# Altium schematic sheet matrix_sh.SchDoc
size A2 portrait
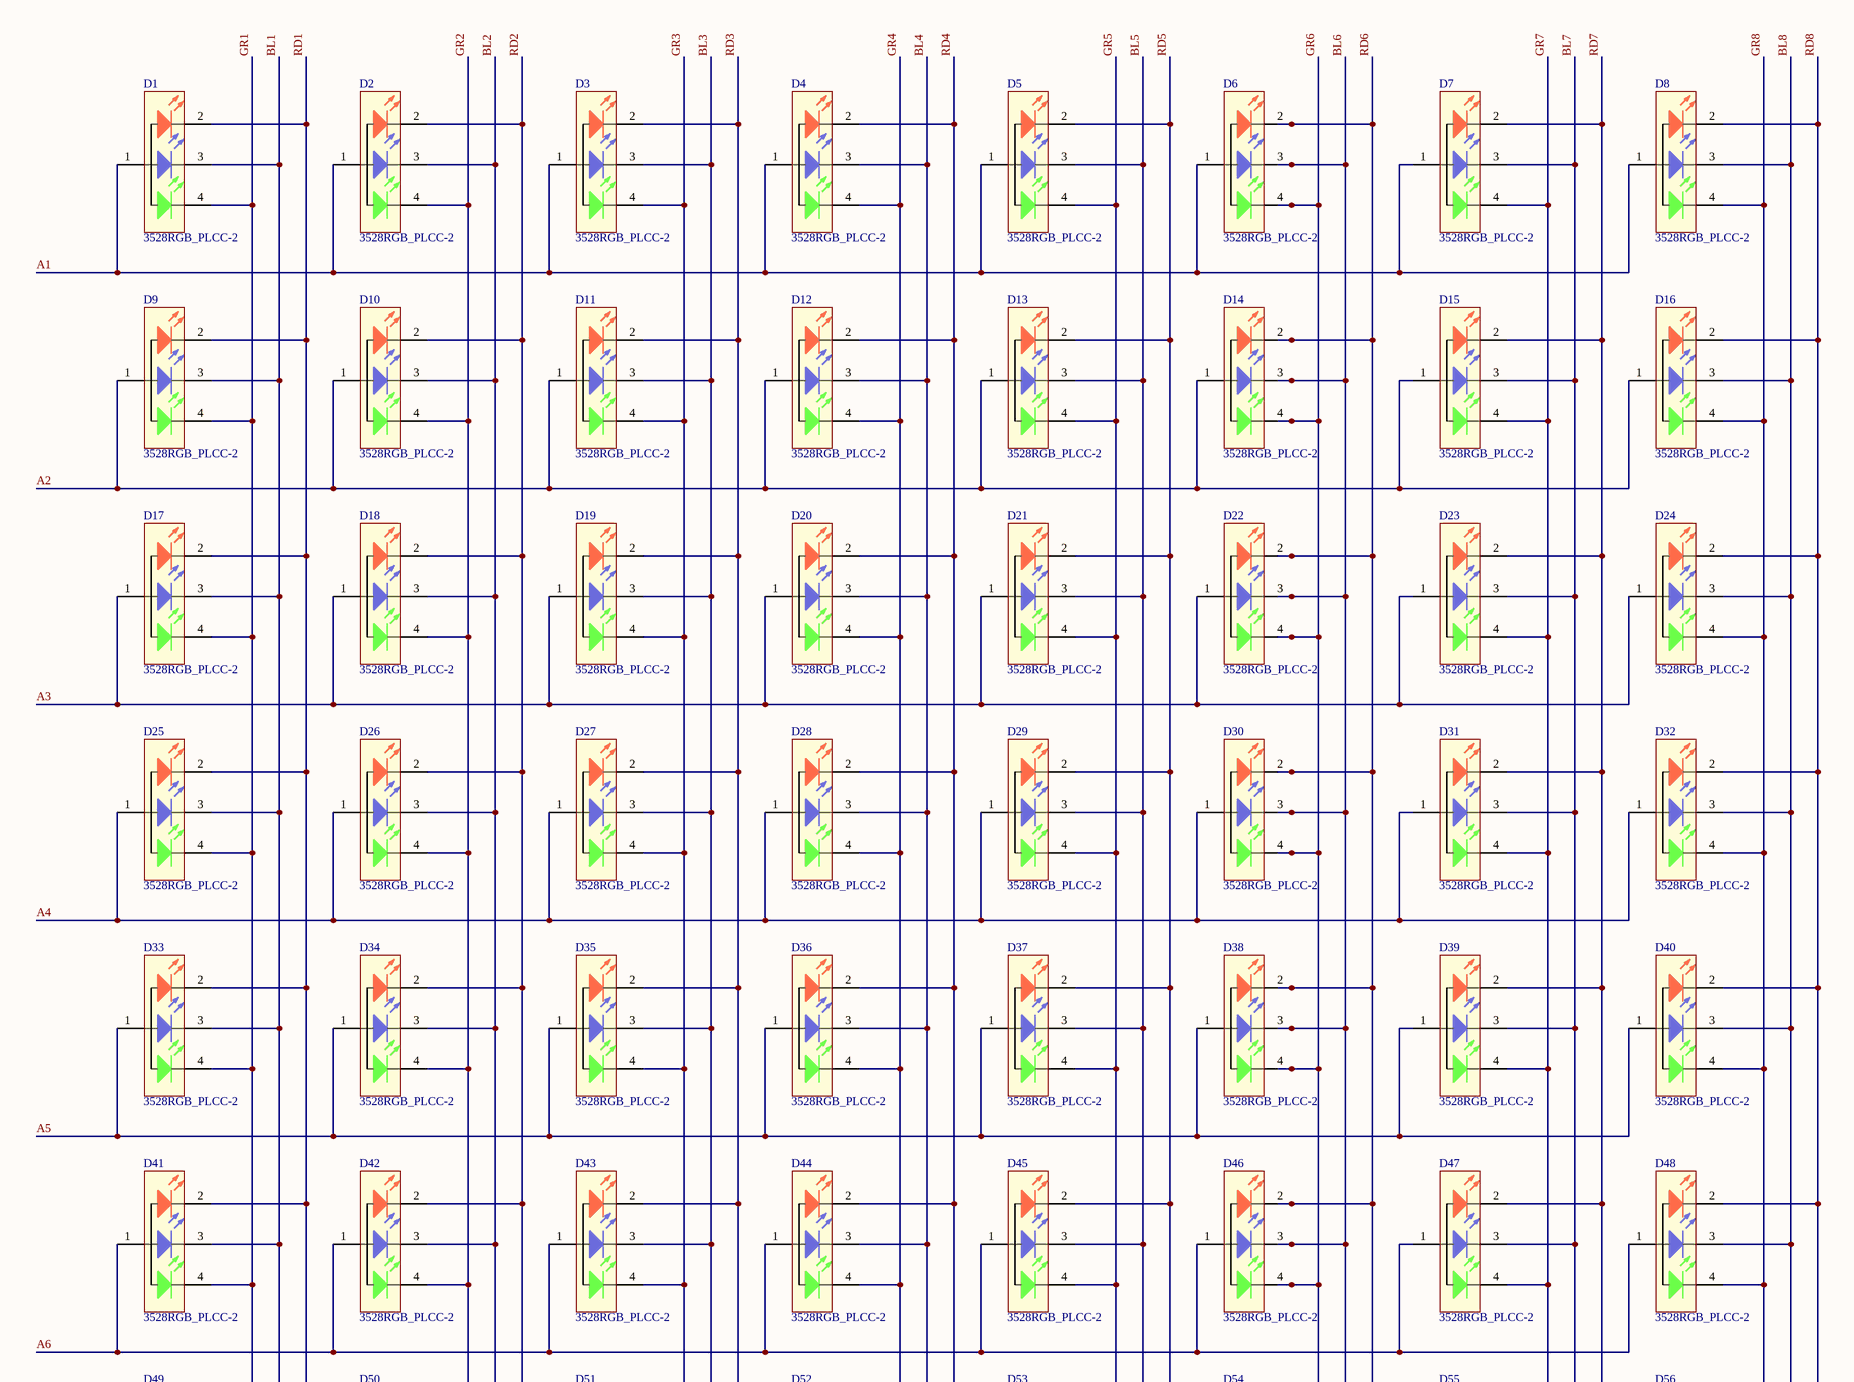
[diagram p0: matrix_sh.SchDoc, top]
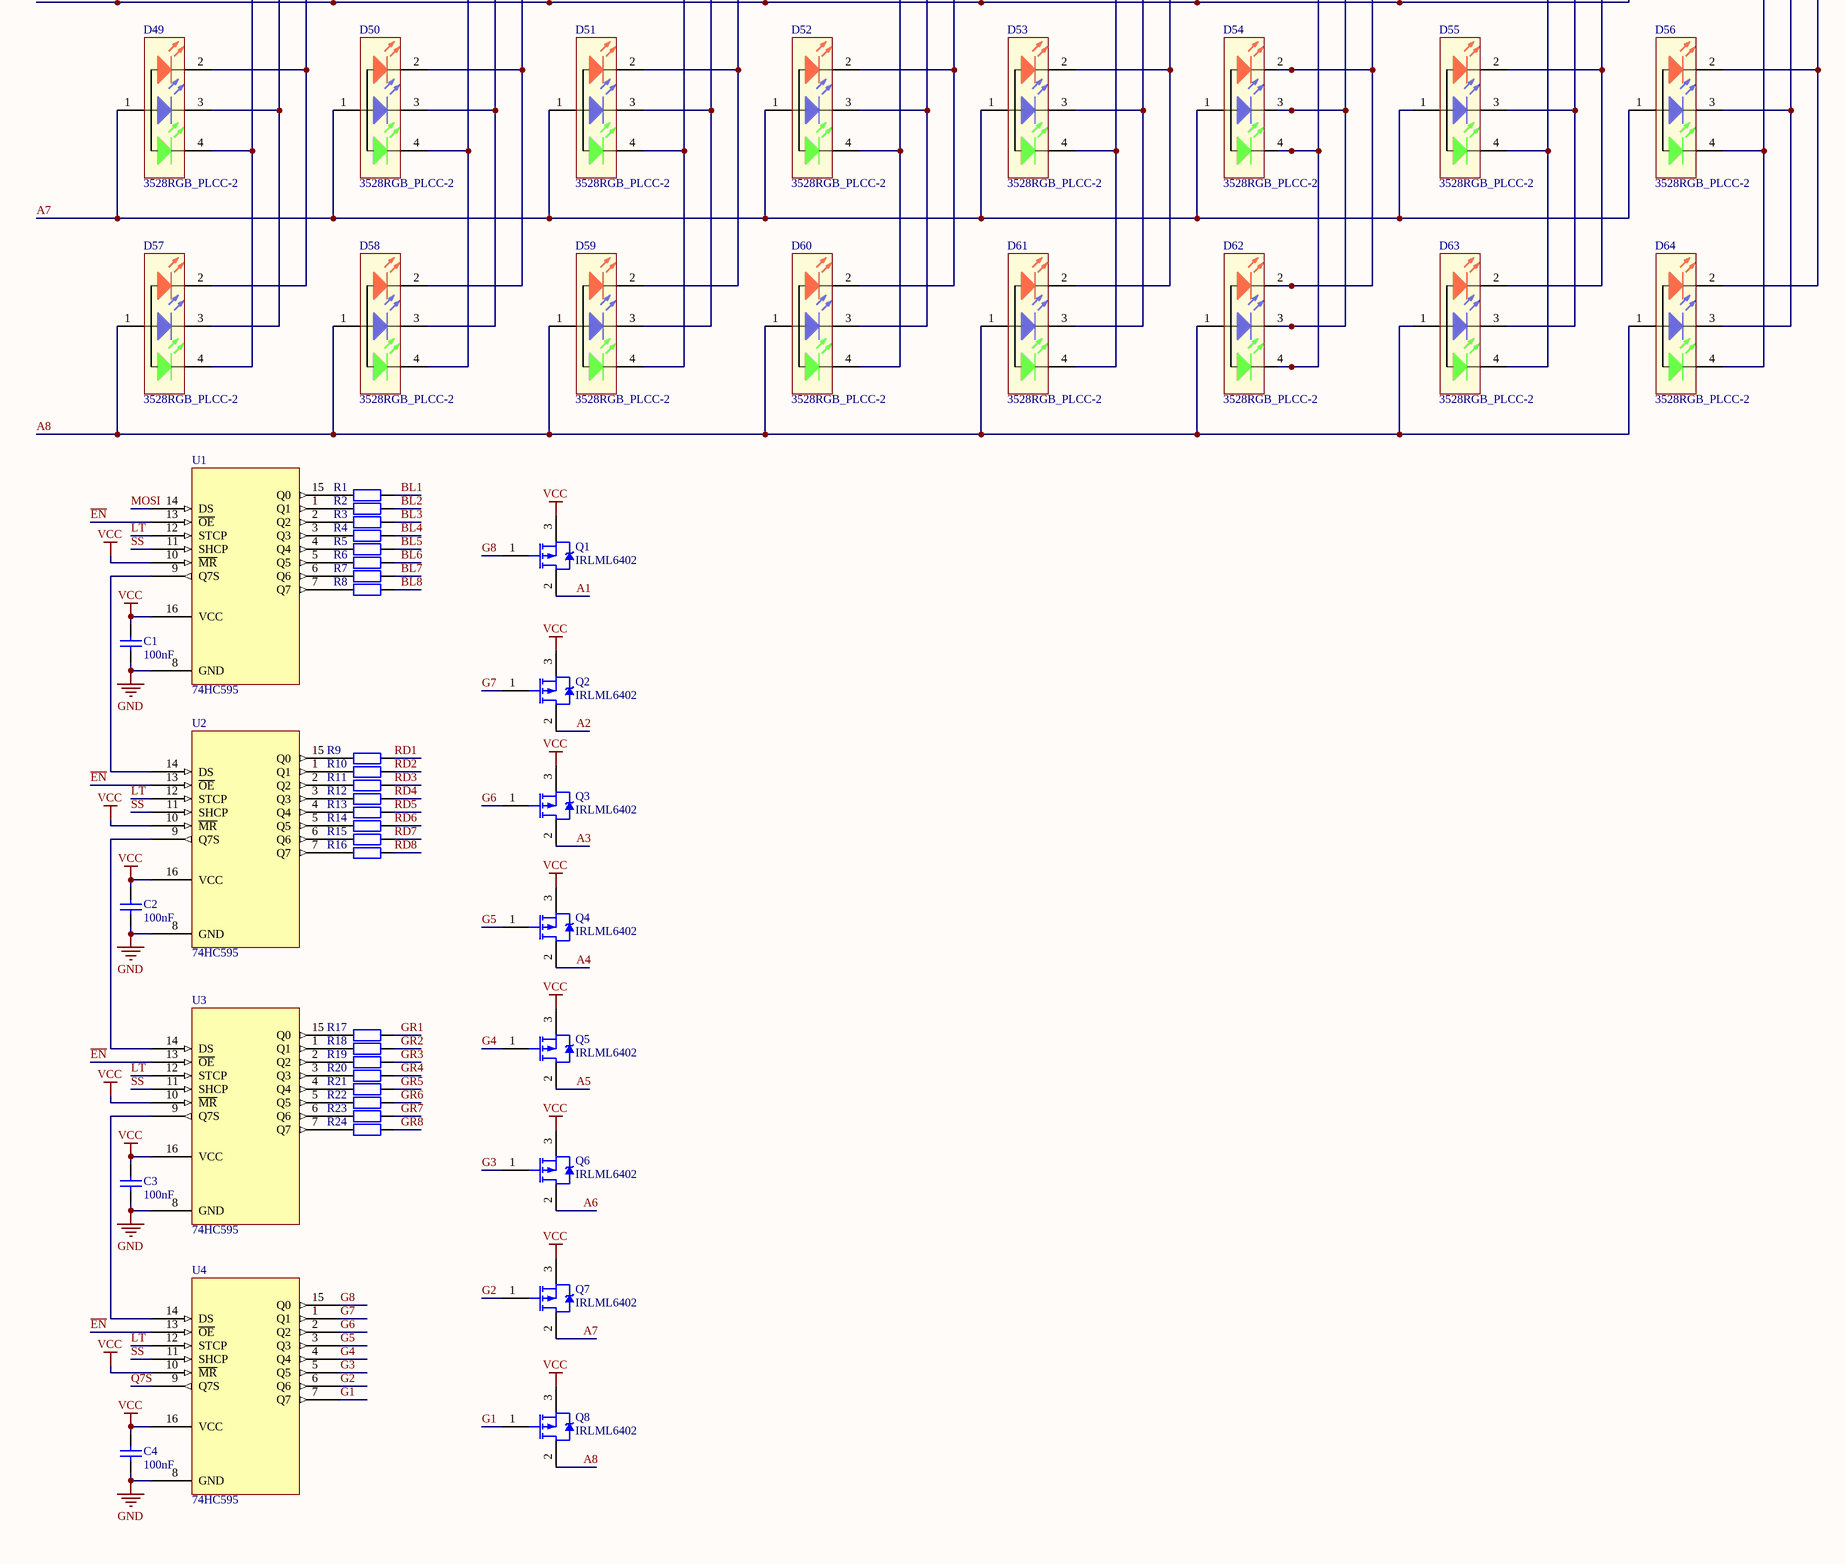
[diagram p1: matrix_sh.SchDoc, bottom]

## Parts
C1  value 100nF  [6-0805_M]  (hidden comment: Cap)
C2  value 100nF  [6-0805_M]  (hidden comment: Cap)
C3  value 100nF  [6-0805_M]  (hidden comment: Cap)
C4  value 100nF  [6-0805_M]  (hidden comment: Cap)
D1  3528RGB_PLCC-2  [PLCC-4 3528]
D2  3528RGB_PLCC-2  [PLCC-4 3528]
D3  3528RGB_PLCC-2  [PLCC-4 3528]
D4  3528RGB_PLCC-2  [PLCC-4 3528]
D5  3528RGB_PLCC-2  [PLCC-4 3528]
D6  3528RGB_PLCC-2  [PLCC-4 3528]
D7  3528RGB_PLCC-2  [PLCC-4 3528]
D8  3528RGB_PLCC-2  [PLCC-4 3528]
D9  3528RGB_PLCC-2  [PLCC-4 3528]
D10  3528RGB_PLCC-2  [PLCC-4 3528]
D11  3528RGB_PLCC-2  [PLCC-4 3528]
D12  3528RGB_PLCC-2  [PLCC-4 3528]
D13  3528RGB_PLCC-2  [PLCC-4 3528]
D14  3528RGB_PLCC-2  [PLCC-4 3528]
D15  3528RGB_PLCC-2  [PLCC-4 3528]
D16  3528RGB_PLCC-2  [PLCC-4 3528]
D17  3528RGB_PLCC-2  [PLCC-4 3528]
D18  3528RGB_PLCC-2  [PLCC-4 3528]
D19  3528RGB_PLCC-2  [PLCC-4 3528]
D20  3528RGB_PLCC-2  [PLCC-4 3528]
D21  3528RGB_PLCC-2  [PLCC-4 3528]
D22  3528RGB_PLCC-2  [PLCC-4 3528]
D23  3528RGB_PLCC-2  [PLCC-4 3528]
D24  3528RGB_PLCC-2  [PLCC-4 3528]
D25  3528RGB_PLCC-2  [PLCC-4 3528]
D26  3528RGB_PLCC-2  [PLCC-4 3528]
D27  3528RGB_PLCC-2  [PLCC-4 3528]
D28  3528RGB_PLCC-2  [PLCC-4 3528]
D29  3528RGB_PLCC-2  [PLCC-4 3528]
D30  3528RGB_PLCC-2  [PLCC-4 3528]
D31  3528RGB_PLCC-2  [PLCC-4 3528]
D32  3528RGB_PLCC-2  [PLCC-4 3528]
D33  3528RGB_PLCC-2  [PLCC-4 3528]
D34  3528RGB_PLCC-2  [PLCC-4 3528]
D35  3528RGB_PLCC-2  [PLCC-4 3528]
D36  3528RGB_PLCC-2  [PLCC-4 3528]
D37  3528RGB_PLCC-2  [PLCC-4 3528]
D38  3528RGB_PLCC-2  [PLCC-4 3528]
D39  3528RGB_PLCC-2  [PLCC-4 3528]
D40  3528RGB_PLCC-2  [PLCC-4 3528]
D41  3528RGB_PLCC-2  [PLCC-4 3528]
D42  3528RGB_PLCC-2  [PLCC-4 3528]
D43  3528RGB_PLCC-2  [PLCC-4 3528]
D44  3528RGB_PLCC-2  [PLCC-4 3528]
D45  3528RGB_PLCC-2  [PLCC-4 3528]
D46  3528RGB_PLCC-2  [PLCC-4 3528]
D47  3528RGB_PLCC-2  [PLCC-4 3528]
D48  3528RGB_PLCC-2  [PLCC-4 3528]
D49  3528RGB_PLCC-2  [PLCC-4 3528]
D50  3528RGB_PLCC-2  [PLCC-4 3528]
D51  3528RGB_PLCC-2  [PLCC-4 3528]
D52  3528RGB_PLCC-2  [PLCC-4 3528]
D53  3528RGB_PLCC-2  [PLCC-4 3528]
D54  3528RGB_PLCC-2  [PLCC-4 3528]
D55  3528RGB_PLCC-2  [PLCC-4 3528]
D56  3528RGB_PLCC-2  [PLCC-4 3528]
D57  3528RGB_PLCC-2  [PLCC-4 3528]
D58  3528RGB_PLCC-2  [PLCC-4 3528]
D59  3528RGB_PLCC-2  [PLCC-4 3528]
D60  3528RGB_PLCC-2  [PLCC-4 3528]
D61  3528RGB_PLCC-2  [PLCC-4 3528]
D62  3528RGB_PLCC-2  [PLCC-4 3528]
D63  3528RGB_PLCC-2  [PLCC-4 3528]
D64  3528RGB_PLCC-2  [PLCC-4 3528]
Q1  IRLML6402  [SOT95P237X112-3N]
Q2  IRLML6402  [SOT95P237X112-3N]
Q3  IRLML6402  [SOT95P237X112-3N]
Q4  IRLML6402  [SOT95P237X112-3N]
Q5  IRLML6402  [SOT95P237X112-3N]
Q6  IRLML6402  [SOT95P237X112-3N]
Q7  IRLML6402  [SOT95P237X112-3N]
Q8  IRLML6402  [SOT95P237X112-3N]
R1  Res2  [6-0805_M]  (value not drawn)
R2  Res2  [6-0805_M]  (value not drawn)
R3  Res2  [6-0805_M]  (value not drawn)
R4  Res2  [6-0805_M]  (value not drawn)
R5  Res2  [6-0805_M]  (value not drawn)
R6  Res2  [6-0805_M]  (value not drawn)
R7  Res2  [6-0805_M]  (value not drawn)
R8  Res2  [6-0805_M]  (value not drawn)
R9  Res2  [6-0805_M]  (value not drawn)
R10  Res2  [6-0805_M]  (value not drawn)
R11  Res2  [6-0805_M]  (value not drawn)
R12  Res2  [6-0805_M]  (value not drawn)
R13  Res2  [6-0805_M]  (value not drawn)
R14  Res2  [6-0805_M]  (value not drawn)
R15  Res2  [6-0805_M]  (value not drawn)
R16  Res2  [6-0805_M]  (value not drawn)
R17  Res2  [6-0805_M]  (value not drawn)
R18  Res2  [6-0805_M]  (value not drawn)
R19  Res2  [6-0805_M]  (value not drawn)
R20  Res2  [6-0805_M]  (value not drawn)
R21  Res2  [6-0805_M]  (value not drawn)
R22  Res2  [6-0805_M]  (value not drawn)
R23  Res2  [6-0805_M]  (value not drawn)
R24  Res2  [6-0805_M]  (value not drawn)
U1  74HC595  [TSOP65P640X110-16M]
U2  74HC595  [TSOP65P640X110-16M]
U3  74HC595  [TSOP65P640X110-16M]
U4  74HC595  [TSOP65P640X110-16M]

## Nets
GND: C1.1 C2.1 C3.1 C4.1 U1.8(GND) U2.8(GND) U3.8(GND) U4.8(GND)
VCC: C1.2 C2.2 C3.2 C4.2 Q1.3(S) Q2.3(S) Q3.3(S) Q4.3(S) Q5.3(S) Q6.3(S) Q7.3(S) Q8.3(S) U1.10(~{MR}) U1.16(VCC) U2.10(~{MR}) U2.16(VCC) U3.10(~{MR}) U3.16(VCC) U4.10(~{MR}) U4.16(VCC)
A1: D1.1(A) D2.1(A) D3.1(A) D4.1(A) D5.1(A) D6.1(A) D7.1(A) D8.1(A) Q1.2(D)
A2: D9.1(A) D10.1(A) D11.1(A) D12.1(A) D13.1(A) D14.1(A) D15.1(A) D16.1(A) Q2.2(D)
A3: D17.1(A) D18.1(A) D19.1(A) D20.1(A) D21.1(A) D22.1(A) D23.1(A) D24.1(A) Q3.2(D)
A4: D25.1(A) D26.1(A) D27.1(A) D28.1(A) D29.1(A) D30.1(A) D31.1(A) D32.1(A) Q4.2(D)
A5: D33.1(A) D34.1(A) D35.1(A) D36.1(A) D37.1(A) D38.1(A) D39.1(A) D40.1(A) Q5.2(D)
A6: D41.1(A) D42.1(A) D43.1(A) D44.1(A) D45.1(A) D46.1(A) D47.1(A) D48.1(A) Q6.2(D)
A7: D49.1(A) D50.1(A) D51.1(A) D52.1(A) D53.1(A) D54.1(A) D55.1(A) D56.1(A) Q7.2(D)
A8: D57.1(A) D58.1(A) D59.1(A) D60.1(A) D61.1(A) D62.1(A) D63.1(A) D64.1(A) Q8.2(D)
BL1: D1.3(K) D9.3(K) D17.3(K) D25.3(K) D33.3(K) D41.3(K) D49.3(K) D57.3(K) R1.2
BL2: D2.3(K) D10.3(K) D18.3(K) D26.3(K) D34.3(K) D42.3(K) D50.3(K) D58.3(K) R2.2
BL3: D3.3(K) D11.3(K) D19.3(K) D27.3(K) D35.3(K) D43.3(K) D51.3(K) D59.3(K) R3.2
BL4: D4.3(K) D12.3(K) D20.3(K) D28.3(K) D36.3(K) D44.3(K) D52.3(K) D60.3(K) R4.2
BL5: D5.3(K) D13.3(K) D21.3(K) D29.3(K) D37.3(K) D45.3(K) D53.3(K) D61.3(K) R5.2
BL6: D6.3(K) D14.3(K) D22.3(K) D30.3(K) D38.3(K) D46.3(K) D54.3(K) D62.3(K) R6.2
BL7: D7.3(K) D15.3(K) D23.3(K) D31.3(K) D39.3(K) D47.3(K) D55.3(K) D63.3(K) R7.2
BL8: D8.3(K) D16.3(K) D24.3(K) D32.3(K) D40.3(K) D48.3(K) D56.3(K) D64.3(K) R8.2
~{EN}: U1.13(~{OE}) U2.13(~{OE}) U3.13(~{OE}) U4.13(~{OE})
G1: Q8.1(G) U4.7(Q7)
G2: Q7.1(G) U4.6(Q6)
G3: Q6.1(G) U4.5(Q5)
G4: Q5.1(G) U4.4(Q4)
G5: Q4.1(G) U4.3(Q3)
G6: Q3.1(G) U4.2(Q2)
G7: Q2.1(G) U4.1(Q1)
G8: Q1.1(G) U4.15(Q0)
GR1: D1.4(K) D9.4(K) D17.4(K) D25.4(K) D33.4(K) D41.4(K) D49.4(K) D57.4(K) R17.2
GR2: D2.4(K) D10.4(K) D18.4(K) D26.4(K) D34.4(K) D42.4(K) D50.4(K) D58.4(K) R18.2
GR3: D3.4(K) D11.4(K) D19.4(K) D27.4(K) D35.4(K) D43.4(K) D51.4(K) D59.4(K) R19.2
GR4: D4.4(K) D12.4(K) D20.4(K) D28.4(K) D36.4(K) D44.4(K) D52.4(K) D60.4(K) R20.2
GR5: D5.4(K) D13.4(K) D21.4(K) D29.4(K) D37.4(K) D45.4(K) D53.4(K) D61.4(K) R21.2
GR6: D6.4(K) D14.4(K) D22.4(K) D30.4(K) D38.4(K) D46.4(K) D54.4(K) D62.4(K) R22.2
GR7: D7.4(K) D15.4(K) D23.4(K) D31.4(K) D39.4(K) D47.4(K) D55.4(K) D63.4(K) R23.2
GR8: D8.4(K) D16.4(K) D24.4(K) D32.4(K) D40.4(K) D48.4(K) D56.4(K) D64.4(K) R24.2
LT: U1.12(STCP) U2.12(STCP) U3.12(STCP) U4.12(STCP)
MOSI: U1.14(DS)
Q7S: U4.9(Q7S)
RD1: D1.2(K) D9.2(K) D17.2(K) D25.2(K) D33.2(K) D41.2(K) D49.2(K) D57.2(K) R9.2
RD2: D2.2(K) D10.2(K) D18.2(K) D26.2(K) D34.2(K) D42.2(K) D50.2(K) D58.2(K) R10.2
RD3: D3.2(K) D11.2(K) D19.2(K) D27.2(K) D35.2(K) D43.2(K) D51.2(K) D59.2(K) R11.2
RD4: D4.2(K) D12.2(K) D20.2(K) D28.2(K) D36.2(K) D44.2(K) D52.2(K) D60.2(K) R12.2
RD5: D5.2(K) D13.2(K) D21.2(K) D29.2(K) D37.2(K) D45.2(K) D53.2(K) D61.2(K) R13.2
RD6: D6.2(K) D14.2(K) D22.2(K) D30.2(K) D38.2(K) D46.2(K) D54.2(K) D62.2(K) R14.2
RD7: D7.2(K) D15.2(K) D23.2(K) D31.2(K) D39.2(K) D47.2(K) D55.2(K) D63.2(K) R15.2
RD8: D8.2(K) D16.2(K) D24.2(K) D32.2(K) D40.2(K) D48.2(K) D56.2(K) D64.2(K) R16.2
SS: U1.11(SHCP) U2.11(SHCP) U3.11(SHCP) U4.11(SHCP)
NetR1_1: R1.1 U1.15(Q0)
NetR2_1: R2.1 U1.1(Q1)
NetR3_1: R3.1 U1.2(Q2)
NetR4_1: R4.1 U1.3(Q3)
NetR5_1: R5.1 U1.4(Q4)
NetR6_1: R6.1 U1.5(Q5)
NetR7_1: R7.1 U1.6(Q6)
NetR8_1: R8.1 U1.7(Q7)
NetR9_1: R9.1 U2.15(Q0)
NetR10_1: R10.1 U2.1(Q1)
NetR11_1: R11.1 U2.2(Q2)
NetR12_1: R12.1 U2.3(Q3)
NetR13_1: R13.1 U2.4(Q4)
NetR14_1: R14.1 U2.5(Q5)
NetR15_1: R15.1 U2.6(Q6)
NetR16_1: R16.1 U2.7(Q7)
NetR17_1: R17.1 U3.15(Q0)
NetR18_1: R18.1 U3.1(Q1)
NetR19_1: R19.1 U3.2(Q2)
NetR20_1: R20.1 U3.3(Q3)
NetR21_1: R21.1 U3.4(Q4)
NetR22_1: R22.1 U3.5(Q5)
NetR23_1: R23.1 U3.6(Q6)
NetR24_1: R24.1 U3.7(Q7)
NetU1_9: U1.9(Q7S) U2.14(DS)
NetU2_9: U2.9(Q7S) U3.14(DS)
NetU3_9: U3.9(Q7S) U4.14(DS)

## Library data of the parts
C1-C4 = Cap: Capacitor; Published: 8-Jun-2000; LatestRevisionDate: 17-Jul-2002; LatestRevisionNote: Re-released for DXP Platform.; PackageReference: RAD-0.3; Publisher: Altium Limited; PackageDescription: Radial Cap, Thru-Hole; 2 Leads; 0.3 in Pin Spacing
R1-R8 R17-R24 = Res2: Resistor; Value: 15; Published: 8-Jun-2000; LatestRevisionDate: 17-Jul-2002; LatestRevisionNote: Re-released for DXP Platform.; PackageReference: AXIAL-0.4; Publisher: Altium Limited; PackageDescription: Axial Device, Thru-Hole; 2 Leads; 0.4 in Pin Spacing
R9-R16 = Res2: Resistor; Value: 68; Published: 8-Jun-2000; LatestRevisionDate: 17-Jul-2002; LatestRevisionNote: Re-released for DXP Platform.; PackageReference: AXIAL-0.4; Publisher: Altium Limited; PackageDescription: Axial Device, Thru-Hole; 2 Leads; 0.4 in Pin Spacing
U1-U4 = 74HC595: NXP